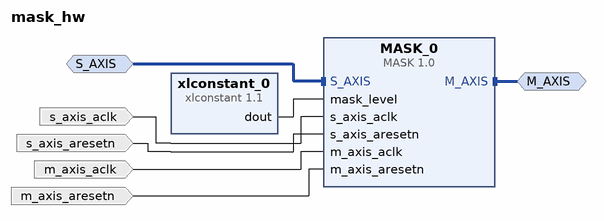
[diagram p0: block diagram of the top level]
# Vivado block design mask_hw, Vivado 2015.3
create_bd_design mask_hw

create_bd_intf_port -mode Slave -vlnv xilinx.com:interface:axis_rtl:1.0 S_AXIS
set_property -dict [list \
  CONFIG.TDATA_NUM_BYTES 4 \
  CONFIG.TDEST_WIDTH 0 \
  CONFIG.TID_WIDTH 0 \
  CONFIG.TUSER_WIDTH 0 \
  CONFIG.HAS_TREADY 1 \
  CONFIG.HAS_TSTRB 1 \
  CONFIG.HAS_TKEEP 0 \
  CONFIG.HAS_TLAST 1 \
  CONFIG.FREQ_HZ 100000000 \
  CONFIG.PHASE 0.000 \
  CONFIG.LAYERED_METADATA undef \
] [get_bd_intf_ports S_AXIS]
create_bd_intf_port -mode Master -vlnv xilinx.com:interface:axis_rtl:1.0 M_AXIS
create_bd_port -dir I -type clk s_axis_aclk
set_property -dict {CONFIG.FREQ_HZ 100000000 CONFIG.ASSOCIATED_BUSIF S_AXIS} [get_bd_ports s_axis_aclk]
create_bd_port -dir I -type rst s_axis_aresetn
create_bd_port -dir I -type clk m_axis_aclk
set_property -dict {CONFIG.FREQ_HZ 100000000 CONFIG.ASSOCIATED_BUSIF M_AXIS} [get_bd_ports m_axis_aclk]
create_bd_port -dir I -type rst m_axis_aresetn

create_bd_cell -type ip -vlnv user.org:user:MASK:1.0 MASK_0
create_bd_cell -type ip -vlnv xilinx.com:ip:xlconstant:1.1 xlconstant_0
set_property -dict {CONFIG.CONST_WIDTH 32 CONFIG.CONST_VAL 8} [get_bd_cells xlconstant_0]

# ---- connections ----

connect_bd_intf_net [get_bd_intf_ports S_AXIS] [get_bd_intf_pins MASK_0/S_AXIS]
connect_bd_intf_net [get_bd_intf_ports M_AXIS] [get_bd_intf_pins MASK_0/M_AXIS]
connect_bd_net [get_bd_pins xlconstant_0/dout] [get_bd_pins MASK_0/mask_level]
connect_bd_net [get_bd_ports s_axis_aclk] [get_bd_pins MASK_0/s_axis_aclk]
connect_bd_net [get_bd_ports s_axis_aresetn] [get_bd_pins MASK_0/s_axis_aresetn]
connect_bd_net [get_bd_ports m_axis_aclk] [get_bd_pins MASK_0/m_axis_aclk]
connect_bd_net [get_bd_ports m_axis_aresetn] [get_bd_pins MASK_0/m_axis_aresetn]

validate_bd_design
save_bd_design
